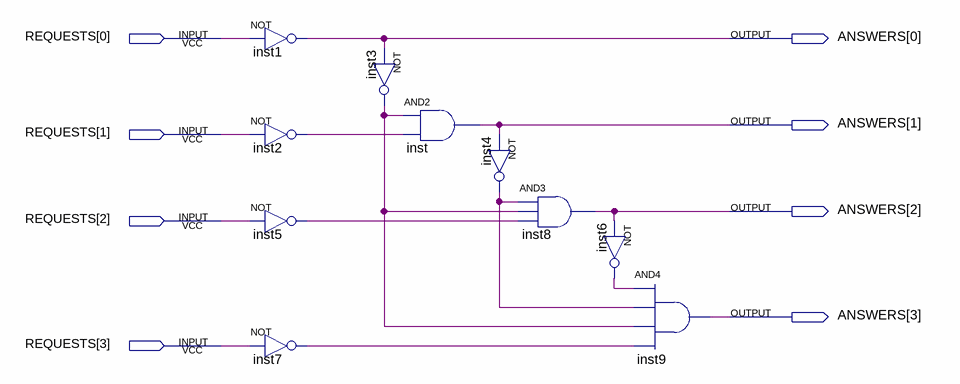
[diagram p0: schematic sheet]
// Quartus schematic device-priority-selector.bdf as structural Verilog: 10 symbols, 8 pins
module \device-priority-selector  (
  input  [3:0] REQUESTS,
  output [3:0] ANSWERS
);

  wire inst2_out, inst3_out, inst4_out, inst5_out, inst6_out, inst7_out;

  not inst1 (ANSWERS[0], REQUESTS[0]);
  not inst2 (inst2_out, REQUESTS[1]);
  not inst5 (inst5_out, REQUESTS[2]);
  not inst7 (inst7_out, REQUESTS[3]);
  not inst3 (inst3_out, ANSWERS[0]);
  and inst (ANSWERS[1], inst3_out, inst2_out);
  not inst4 (inst4_out, ANSWERS[1]);
  and inst8 (ANSWERS[2], inst4_out, inst3_out, inst5_out);
  not inst6 (inst6_out, ANSWERS[2]);
  and inst9 (ANSWERS[3], inst6_out, inst4_out, inst3_out, inst7_out);
endmodule
